# EAGLE design SciQuest_NRF_Mesh (EAGLE 7.1.0)
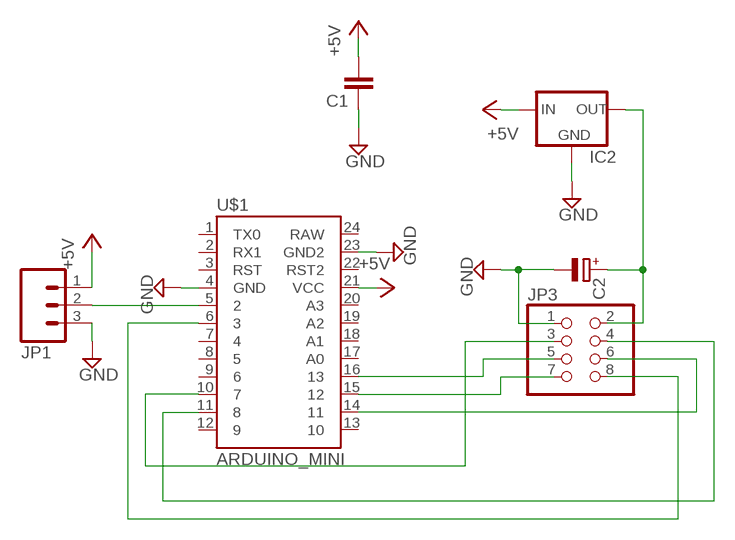
[diagram p0: schematic, sheet 1]

## Parts
C1  C-EUC0805K  [C0805K]
C2  CPOL-EUE2-4  [E2-4]
IC2  78LXX  [78LXX]
JP1  M03LONGPADS  [1X03_LONGPADS]
JP3  PINHD-2X4  [2X04]
U$1  ARDUINO_MINI  [ARDUINO_MINI]

## Nets
+5V: C1.2 IC2.IN JP1.1 U$1.21(VCC)
GND: C1.1 C2.- IC2.GND JP1.3 JP3.1 U$1.4(GND) U$1.23(GND2)
N$1: C2.+ IC2.OUT JP3.2
N$3: JP1.2 U$1.5
N$4: JP3.3 U$1.10
N$5: JP3.4 U$1.11
N$6: JP3.5 U$1.16
N$7: JP3.7 U$1.15
N$8: JP3.6 U$1.14
N$9: JP3.8 U$1.6
Unconnected: U$1.1(TX0) U$1.2(RX1) U$1.3(RST) U$1.7 U$1.8 U$1.9 U$1.12 U$1.13 U$1.17(A0) U$1.18(A1) U$1.19(A2) U$1.20(A3) U$1.22(RST2) U$1.24(RAW)

## Library data of the parts
C1 = rcl:C-EU: CAPACITOR, European symbol
C2 = rcl:CPOL-EU: POLARIZED CAPACITOR, European symbol
IC2 = v-reg:78LXX: VOLTAGE REGULATOR
JP1 = SparkFun:M03: Header 3 Standard 3-pin 0.1" header. Use with straight break away headers (SKU : PRT-00116), right angle break away headers (PRT-00553), swiss pins (PRT-00743), machine pins (PRT-00117), and female headers (PRT-00115). Molex polarized connector foot print use with SKU : PRT-08232 with associated crimp pins and housings.
JP3 = pinhead:PINHD-2X4: PIN HEADER
U$1 = SparkFun:ARDUINO_MINI

## Board
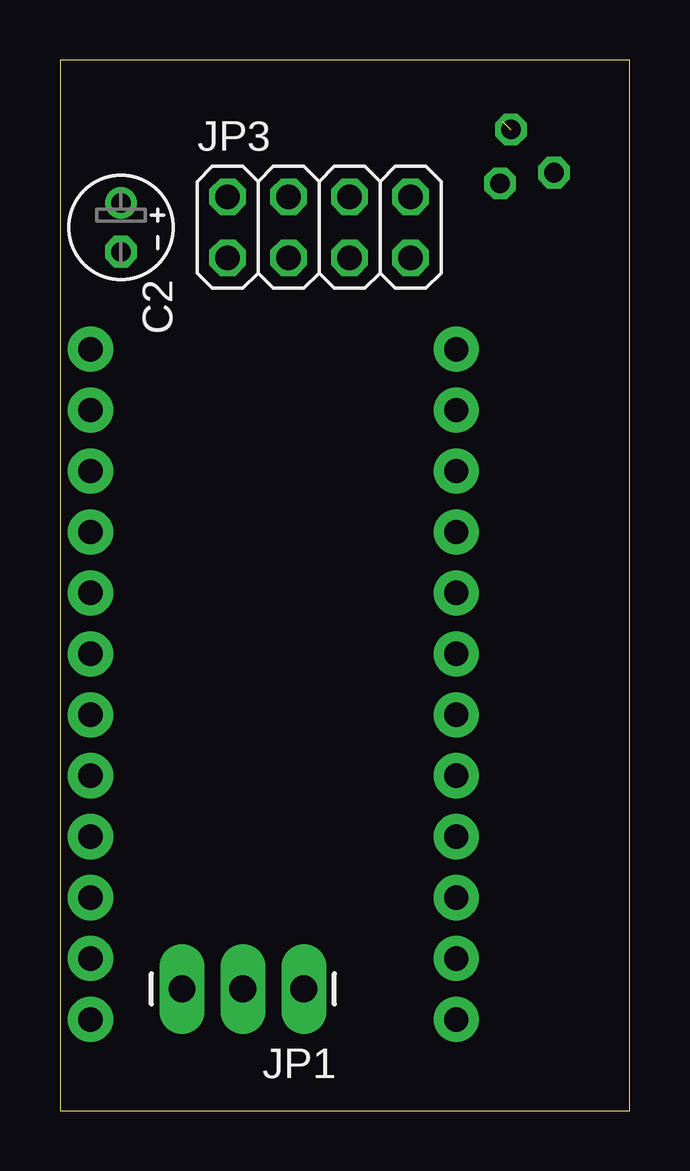
[diagram p1: board, top side]
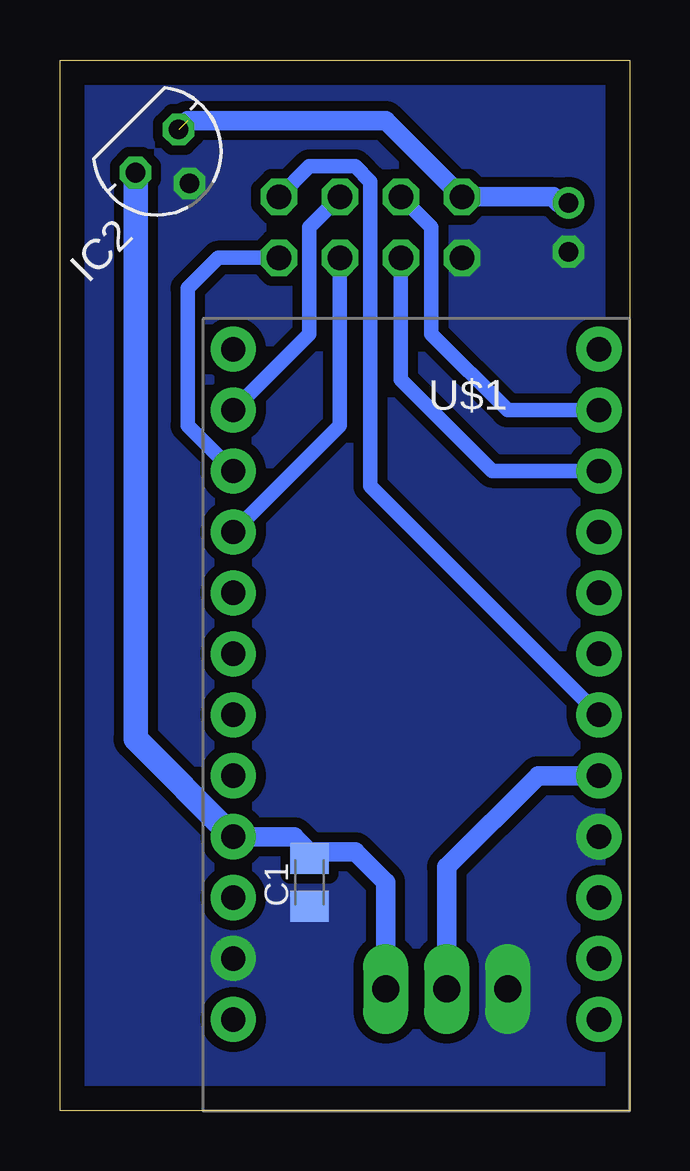
[diagram p2: board, bottom side, seen from below]

Size 23.73 x 43.8 mm. Coordinates in mm from the lower left corner, seen from the top.
Outline: 0,0 23.73,0 23.73,43.8 0,43.8 0,0
Copper layers (1*16): Top 0.035mm / dielectric 1.5mm / Bottom 0.035mm
Design rules "default": minimum track width 10mil, minimum drill 24mil, track to track 8mil, track to pad 8mil, pad to pad 8mil, via to via 8mil, smd to smd 8mil, copper to edge 40mil, drill to drill 8mil, minimum pad ring 10mil, minimum via ring 8mil, stop-mask expansion 4mil, vias tented up to drill 0mil, thermal gap 10mil

### Footprints (pad centres in the part's own frame; a part is rotated, then mirrored left to right if it is on the bottom)
C0805K = smd 1.3 x 1.6: 1 -1,0; 2 1,0
E2-4 = drill 0.813 pad 1.27: + -1.016,0 | drill 0.813 pad 1.27 octagon: - 1.016,0
78LXX = drill 0.813 octagon: GND 0,1.905; IN 1.27,0; OUT -1.27,0
1X03_LONGPADS = drill 1.118 pad 1.88 long: 1 0,0; 2 2.54,0; 3 5.08,0
2X04 = drill 1.016 octagon: 1 -3.81,-1.27; 2 -3.81,1.27; 3 -1.27,-1.27; 4 -1.27,1.27; 5 1.27,-1.27; 6 1.27,1.27; 7 3.81,-1.27; 8 3.81,1.27
ARDUINO_MINI = drill 1.016 pad 1.88: 1 -7.62,12.7; 2 -7.62,10.16; 3 -7.62,7.62; 4 -7.62,5.08; 5 -7.62,2.54; 6 -7.62,0; 7 -7.62,-2.54; 8 -7.62,-5.08; 9 -7.62,-7.62; 10 -7.62,-10.16; 11 -7.62,-12.7; 12 -7.62,-15.24; 13 7.62,-15.24; 14 7.62,-12.7; 15 7.62,-10.16; 16 7.62,-7.62; 17 7.62,-5.08; 18 7.62,-2.54; 19 7.62,0; 20 7.62,2.54; 21 7.62,5.08; 22 7.62,7.62; 23 7.62,10.16; 24 7.62,12.7

### Placement (x,y rotation side)
C1  13.34,9.53 90 bottom
C2  2.54,36.83 270 top
IC2  19.68,40.01 225 bottom
JP1  10.16,5.08 180 top
JP3  10.79,36.83 0 top
U$1  8.89,16.51 180 bottom

### Tracks (layer width: path | path; a pad name or v marks a point on that pad's centre or on a via)
+5V
  Bottom 0.813: JP1.1 10.16,9.53 11.43,10.79 13.06,10.79 C1.2 13.34,10.79 13.97,11.43 U$1.21
  Bottom 1.016: IC2.IN 20.58,15.5 U$1.21
GND
  pour Bottom (isolate 0.406, no thermals): 0,43.18 23.5,43.18 23.5,0 0,0
N$1  (1 unrouted)
  Bottom 0.813: C2.+ 2.92,37.85 3.17,38.1 JP3.2 10.16,41.27 18.41,41.27
N$3
  Bottom 0.813: U$1.5 3.81,13.97 7.62,10.16 JP1.2
N$4
  Bottom 0.61: JP3.3 9.53,30.48 5.71,26.67 U$1.10
N$5
  Bottom 0.61: JP3.4 8.26,36.83 8.26,32.38 5.08,29.21 U$1.11
N$6
  Bottom 0.61: JP3.5 12.06,28.57 U$1.16
N$7
  Bottom 0.61: JP3.7 17.14,35.56 18.41,34.29 18.41,28.57 U$1.15
N$8
  Bottom 0.61: JP3.6 13.34,36.83 13.34,32.38 U$1.14
N$9
  Bottom 0.61: JP3.8 13.34,39.37 11.43,39.37 10.79,38.73 10.79,26.04 U$1.6